# Altium schematic sheet LEDs.SchDoc
size A
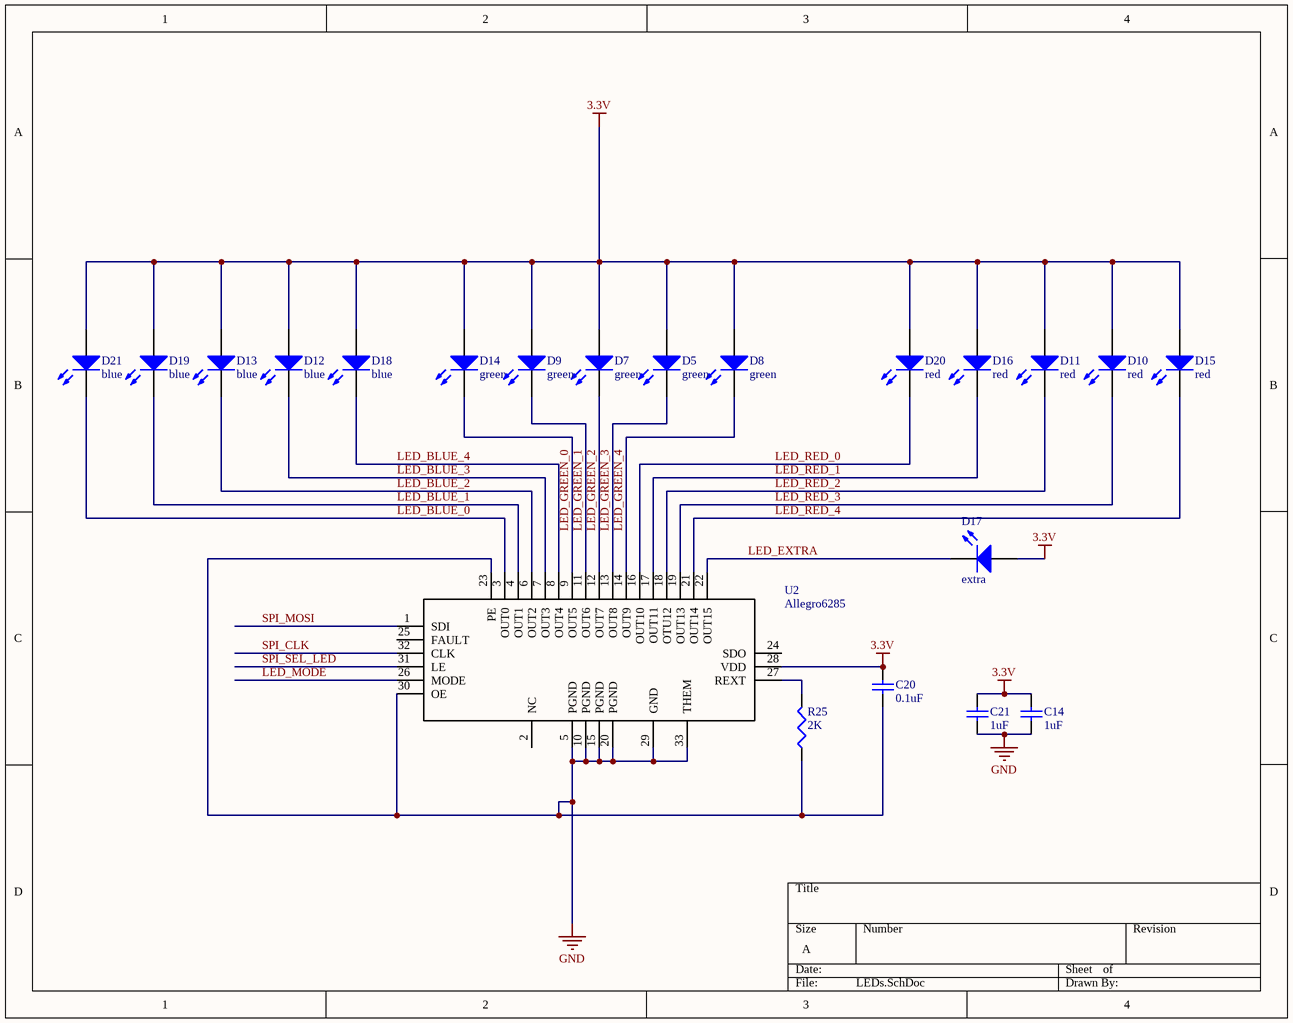
[diagram p0: LEDs.SchDoc]

## Parts
C14  value 1uF  [CAPC1608L]  (hidden comment: Cap Semi)
C20  value 0.1uF  [CAPC1005L]  (hidden comment: Cap Semi)
C21  value 1uF  [CAPC1608L]  (hidden comment: Cap Semi)
D5  green  [SurfaceMount(603)]
D7  green  [SurfaceMount(603)]
D8  green  [SurfaceMount(603)]
D9  green  [SurfaceMount(603)]
D10  red  [SurfaceMount(603)]
D11  red  [SurfaceMount(603)]
D12  blue  [SurfaceMount(603)]
D13  blue  [SurfaceMount(603)]
D14  green  [SurfaceMount(603)]
D15  red  [SurfaceMount(603)]
D16  red  [SurfaceMount(603)]
D17  extra  [SurfaceMount(603)]
D18  blue  [SurfaceMount(603)]
D19  blue  [SurfaceMount(603)]
D20  red  [SurfaceMount(603)]
D21  blue  [SurfaceMount(603)]
R25  value 2K  [RESC1608L]  (hidden comment: Res3)
U2  Allegro6285  [QFN-32]

## Nets
3.3V: C14.2 C20.2 C21.2 D5.1(A) D7.1(A) D8.1(A) D9.1(A) D10.1(A) D11.1(A) D12.1(A) D13.1(A) D14.1(A) D15.1(A) D16.1(A) D17.1(A) D18.1(A) D19.1(A) D20.1(A) D21.1(A) U2.28(VDD)
GND: C14.1 C20.1 C21.1 R25.1 U2.5(PGND) U2.10(PGND) U2.15(PGND) U2.20(PGND) U2.23(PE) U2.29(GND) U2.30(OE) U2.33(THEM)
LED_BLUE_0: D21.2(K) U2.3(OUT0)
LED_BLUE_1: D19.2(K) U2.4(OUT1)
LED_BLUE_2: D13.2(K) U2.6(OUT2)
LED_BLUE_3: D12.2(K) U2.7(OUT3)
LED_BLUE_4: D18.2(K) U2.8(OUT4)
LED_EXTRA: D17.2(K) U2.22(OUT15)
LED_GREEN_0: D14.2(K) U2.9(OUT5)
LED_GREEN_1: D9.2(K) U2.11(OUT6)
LED_GREEN_2: D7.2(K) U2.12(OUT7)
LED_GREEN_3: D5.2(K) U2.13(OUT8)
LED_GREEN_4: D8.2(K) U2.14(OUT9)
LED_MODE: U2.26(MODE)
LED_RED_0: D20.2(K) U2.16(OUT10)
LED_RED_1: D16.2(K) U2.17(OUT11)
LED_RED_2: D11.2(K) U2.18(OTU12)
LED_RED_3: D10.2(K) U2.19(OUT13)
LED_RED_4: D15.2(K) U2.21(OUT14)
SPI_CLK: U2.32(CLK)
SPI_MOSI: U2.1(SDI)
SPI_SEL_LED: U2.31(LE)
NetR25_2: R25.2 U2.27(REXT)

Not connected (* = marked no-connect by the designer): U2 2(NC) 24(SDO) 25(FAULT)

## Library data of the parts
C14 C20 C21 = Cap Semi: Capacitor (Semiconductor SIM Model); Published: 8-Jun-2000; LatestRevisionDate: 29-May-2009; LatestRevisionNote: IPC-7351 Footprint Added.; PackageReference: C1206; Publisher: Altium Limited; PackageDescription: Chip Capacitor
D5 D7-D21 = LED
R25 = Res3: Resistor; Published: 8-Jun-2000; LatestRevisionDate: 29-May-2009; LatestRevisionNote: IPC-7351 Footprint Added.; PackageReference: J1-0603; Publisher: Altium Limited; PackageDescription: Chip Resistor